# Altium schematic sheet BV100011_ControlSTM32H7.SchDoc
size A3
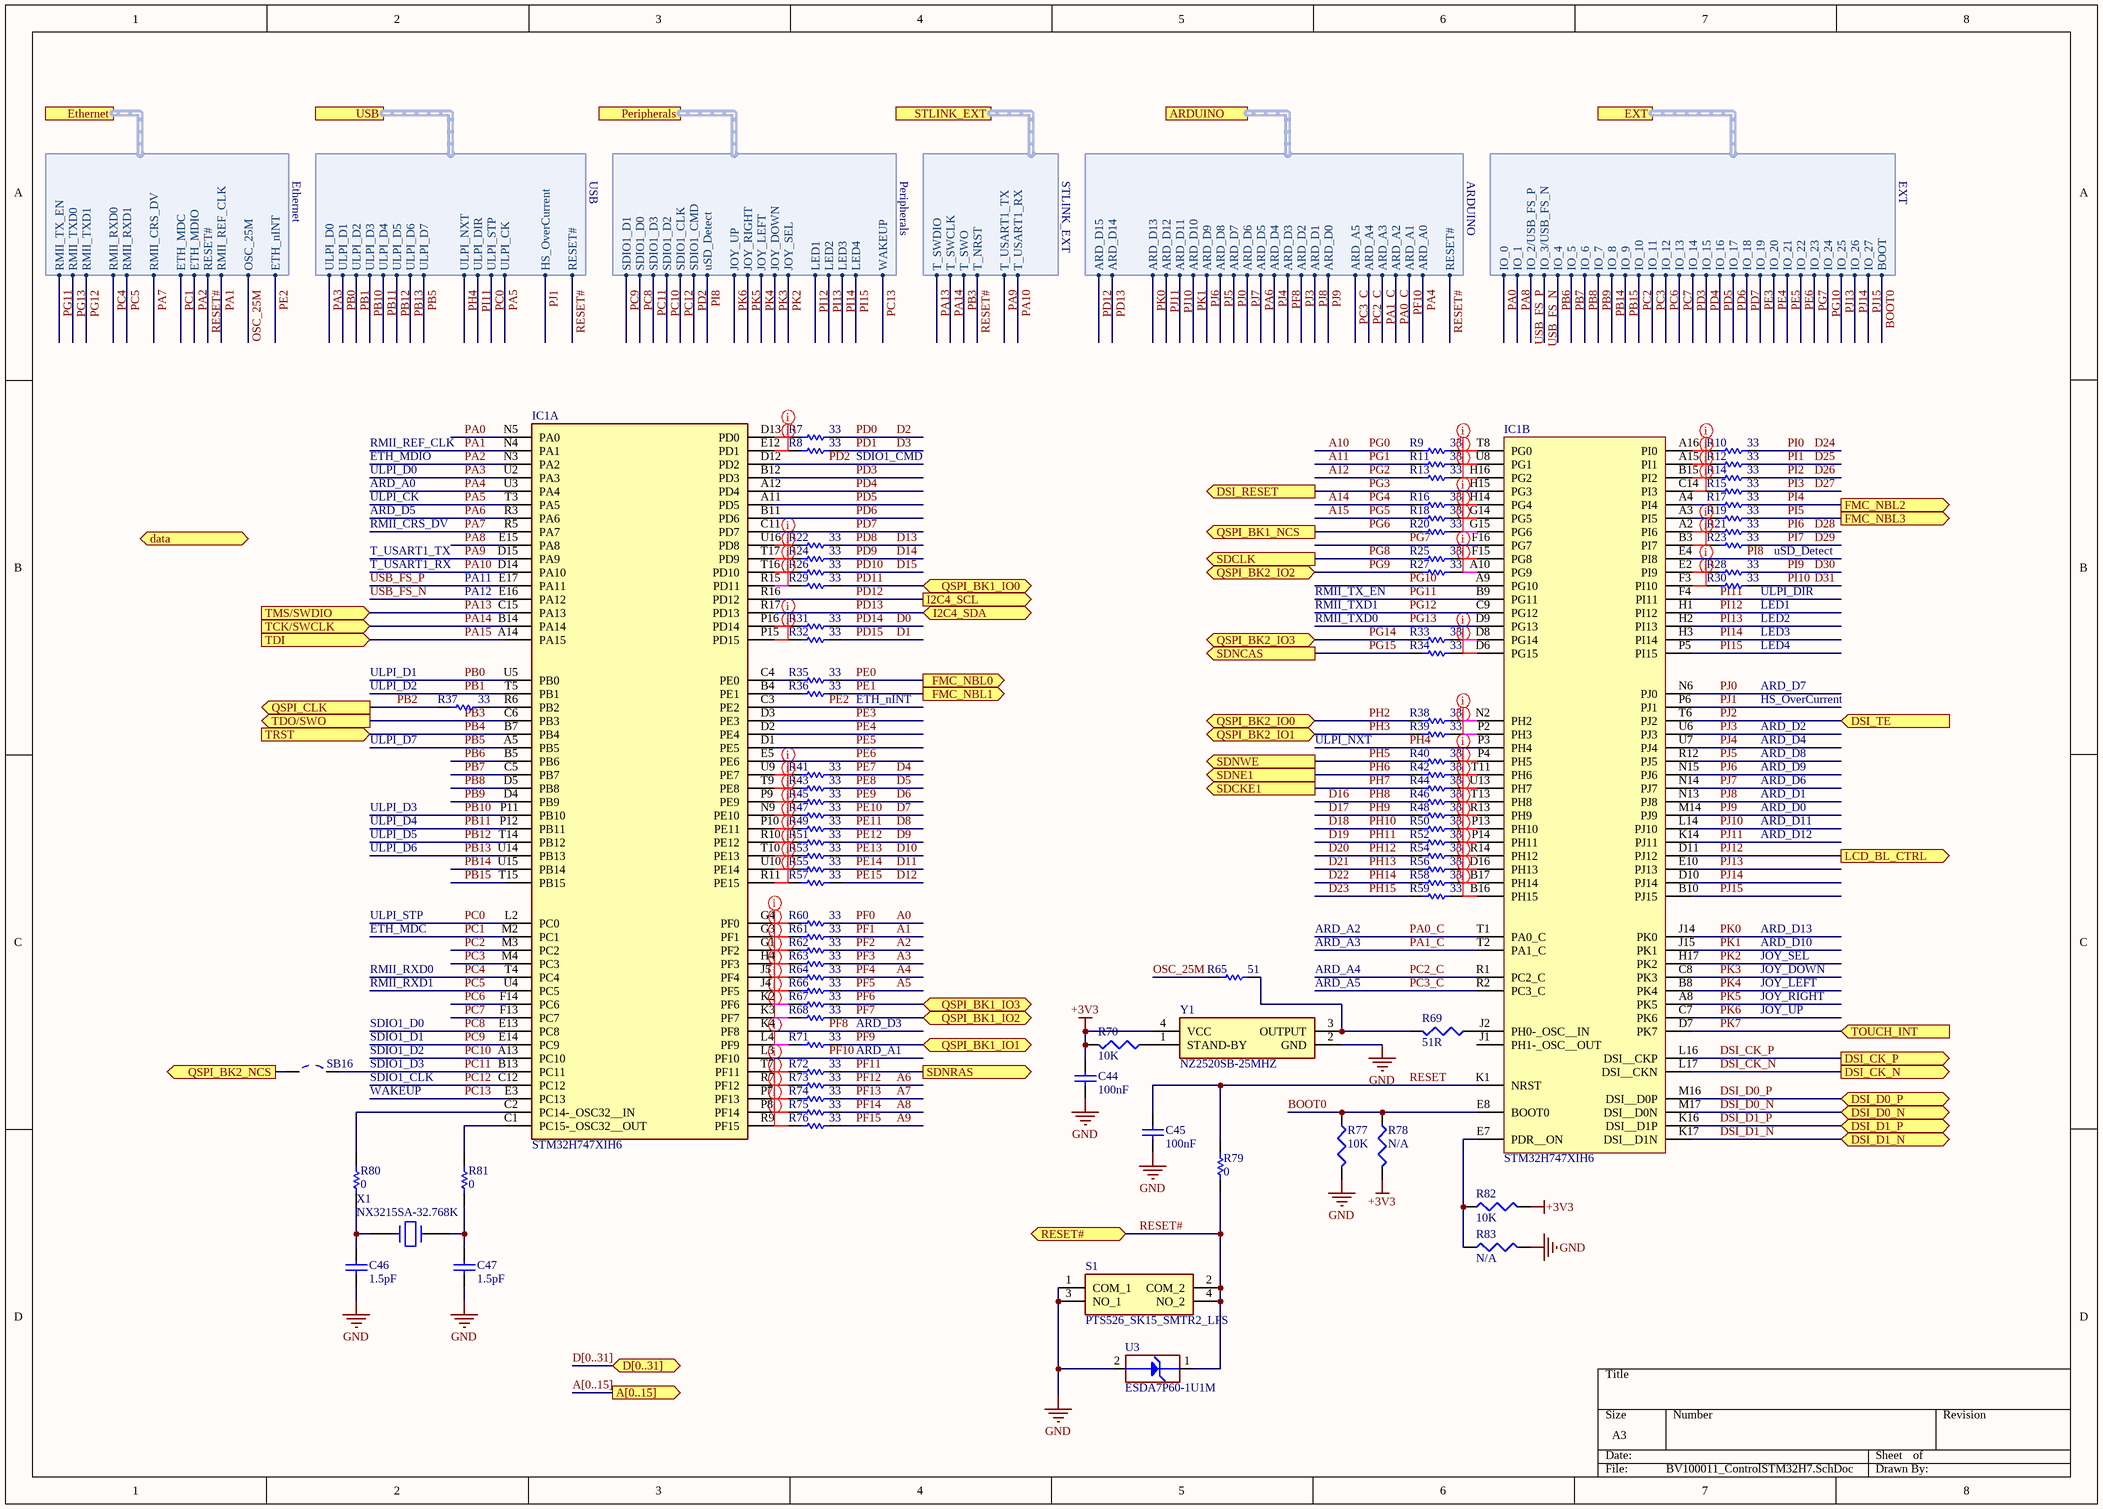
[diagram p0: BV100011_ControlSTM32H7.SchDoc]

## Parts
C44  100nF  [C0402]
C45  100nF  [C0402]
C46  value 1.5pF  [C0402]  (hidden comment: Capacitor)
C47  value 1.5pF  [C0402]  (hidden comment: Capacitor)
IC1  STM32H747XIH6  [BGA265C80P17X17_1400X1400X110]  (parts A,B of 3)
R7  33  [R0402]
R8  33  [R0402]
R9  33  [R0402]
R10  33  [R0402]
R11  33  [R0402]
R12  33  [R0402]
R13  33  [R0402]
R14  33  [R0402]
R15  33  [R0402]
R16  33  [R0402]
R17  33  [R0402]
R18  33  [R0402]
R19  33  [R0402]
R20  33  [R0402]
R21  33  [R0402]
R22  33  [R0402]
R23  33  [R0402]
R24  33  [R0402]
R25  33  [R0402]
R26  33  [R0402]
R27  33  [R0402]
R28  33  [R0402]
R29  33  [R0402]
R30  33  [R0402]
R31  33  [R0402]
R32  33  [R0402]
R33  33  [R0402]
R34  33  [R0402]
R35  33  [R0402]
R36  33  [R0402]
R37  33  [R0402]
R38  33  [R0402]
R39  33  [R0402]
R40  33  [R0402]
R41  33  [R0402]
R42  33  [R0402]
R43  33  [R0402]
R44  33  [R0402]
R45  33  [R0402]
R46  33  [R0402]
R47  33  [R0402]
R48  33  [R0402]
R49  33  [R0402]
R50  33  [R0402]
R51  33  [R0402]
R52  33  [R0402]
R53  33  [R0402]
R54  33  [R0402]
R55  33  [R0402]
R56  33  [R0402]
R57  33  [R0402]
R58  33  [R0402]
R59  33  [R0402]
R60  33  [R0402]
R61  33  [R0402]
R62  33  [R0402]
R63  33  [R0402]
R64  33  [R0402]
R65  51  [R0402]
R66  33  [R0402]
R67  33  [R0402]
R68  33  [R0402]
R69  51R  [R0402]
R70  10K  [R0402]
R71  33  [R0402]
R72  33  [R0402]
R73  33  [R0402]
R74  33  [R0402]
R75  33  [R0402]
R76  33  [R0402]
R77  10K  [R0603]
R78  N/A  [R0603]
R79  0  [R0603]
R80  0  [R0603]
R81  0  [R0603]
R82  10K  [R0603]
R83  N/A  [R0603]
S1  PTS526_SK15_SMTR2_LFS  [PTS526SK15SMTR2LFS]
SB16  Solder Bridge OFF  [SB_0603]  (value not drawn)
U3  value ESDA7P60-1U1M  [ESD_QFN2_1P6X1_P125]  (hidden comment: ESD-TRANSIL)
X1  value NX3215SA-32.768K  [CRY_NX3215SA_2P]  (hidden comment: XTAL_32K_NX3215SA)
Y1  NZ2520SB-25MHZ  [OSC_NDK_NZ2520SB_4P]

## Ports
A[0..15] (out), ARDUINO (harness ARDUINO), D[0..31] (bidir), data (bidir), DSI_CK_N (out), DSI_CK_P (out), DSI_D0_N (bidir), DSI_D0_P (bidir), DSI_D1_N (bidir), DSI_D1_P (bidir), DSI_RESET (out), DSI_TE (in), Ethernet (harness Ethernet), EXT (harness EXT), FMC_NBL0 (out), FMC_NBL1 (out), FMC_NBL2 (out), FMC_NBL3 (out), I2C4_SCL (out), I2C4_SDA (bidir), LCD_BL_CTRL (out), Peripherals (harness Peripherals), QSPI_BK1_IO0 (bidir), QSPI_BK1_IO1 (bidir), QSPI_BK1_IO2 (bidir), QSPI_BK1_IO3 (bidir), QSPI_BK1_NCS (out), QSPI_BK2_IO0 (bidir), QSPI_BK2_IO1 (bidir), QSPI_BK2_IO2 (bidir), QSPI_BK2_IO3 (bidir), QSPI_BK2_NCS (out), QSPI_CLK (out), RESET# (bidir), SDCKE1 (out), SDCLK (out), SDNCAS (out), SDNE1 (out), SDNRAS (out), SDNWE (out), STLINK_EXT (harness STLINK_EXT), TCK/SWCLK (in), TDI (in), TDO/SWO (out), TMS/SWDIO (in), TOUCH_INT (in), TRST (in), USB (harness USB)

## Harnesses
Ethernet: ETH_nINT, ETH_MDC, RMII_REF_CLK, RMII_TXD1, ETH_MDIO, RMII_CRS_DV, RMII_RXD0, RMII_RXD1, RMII_TX_EN, RMII_TXD0, OSC_25M, RESET#
USB: ULPI_D0, ULPI_D1, ULPI_D2, ULPI_D3, ULPI_D4, ULPI_D5, ULPI_D6, ULPI_D7, ULPI_NXT, ULPI_DIR, ULPI_STP, ULPI_CK, RESET#, HS_OverCurrent
Peripherals: SDIO1_D1, SDIO1_D0, SDIO1_D3, SDIO1_D2, SDIO1_CLK, SDIO1_CMD, uSD_Detect, JOY_UP, JOY_RIGHT, JOY_LEFT, JOY_DOWN, JOY_SEL, LED1, LED2, LED3, LED4, WAKEUP
STLINK_EXT: T_SWDIO, T_SWCLK, T_SWO, T_NRST, T_USART1_TX, T_USART1_RX
ARDUINO: RESET#, ARD_A0, ARD_A1, ARD_A2, ARD_A3, ARD_A4, ARD_A5, ARD_D4, ARD_D3, ARD_D2, ARD_D1, ARD_D0, ARD_D9, ARD_D8, ARD_D7, ARD_D6, ARD_D5, ARD_D14, ARD_D13, ARD_D12, ARD_D11, ARD_D10, ARD_D15
EXT: IO_0, IO_1, IO_3/USB_FS_N, IO_4, IO_5, IO_6, IO_7, IO_8, IO_9, IO_10, IO_11, IO_12, IO_13, IO_14, IO_15, IO_16, IO_17, IO_18, IO_19, IO_20, IO_21, IO_22, IO_23, IO_24, IO_25, IO_26, IO_27, BOOT, IO_2/USB_FS_P

## Nets
+3V3: C44.2 R70.2 R78.2 R82.2 Y1.4(VCC)
GND: C44.1 C45.1 C46.1 C47.1 R77.2 R83.2 S1.1(COM_1) S1.3(NO_1) U3.2(GND) Y1.2(GND)
A0: R60.1  [also labelled PF0]
A1: R61.1  [also labelled PF1]
A2: R62.1  [also labelled PF2]
A3: R63.1  [also labelled PF3]
A4: R64.1  [also labelled PF4]
A5: R66.1  [also labelled PF5]
A6: R73.1  [also labelled PF12]
A7: R74.1  [also labelled PF13]
A8: R75.1  [also labelled PF14]
A9: R76.1  [also labelled PF15]
A10: R9.2  [also labelled PG0]
A11: R11.2  [also labelled PG1]
A12: R13.2  [also labelled PG2]
A14: R16.2  [also labelled PG4]
A15: R18.2  [also labelled PG5]
BOOT0: IC1.E8(BOOT0) R77.1 R78.1 ; port EXT.BOOT
D0: R31.1  [also labelled PD14]
D1: R32.1  [also labelled PD15]
D2: R7.1  [also labelled PD0]
D3: R8.1  [also labelled PD1]
D4: R41.1  [also labelled PE7]
D5: R43.1  [also labelled PE8]
D6: R45.1  [also labelled PE9]
D7: R47.1  [also labelled PE10]
D8: R49.1  [also labelled PE11]
D9: R51.1  [also labelled PE12]
D10: R53.1  [also labelled PE13]
D11: R55.1  [also labelled PE14]
D12: R57.1  [also labelled PE15]
D13: R22.1  [also labelled PD8]
D14: R24.1  [also labelled PD9]
D15: R26.1  [also labelled PD10]
D16: R46.2  [also labelled PH8]
D17: R48.2  [also labelled PH9]
D18: R50.2  [also labelled PH10]
D19: R52.2  [also labelled PH11]
D20: R54.2  [also labelled PH12]
D21: R56.2  [also labelled PH13]
D22: R58.2  [also labelled PH14]
D23: R59.2  [also labelled PH15]
D24: R10.1  [also labelled PI0]
D25: R12.1  [also labelled PI1]
D26: R14.1  [also labelled PI2]
D27: R15.1  [also labelled PI3]
D28: R21.1  [also labelled PI6]
D29: R23.1  [also labelled PI7]
D30: R28.1  [also labelled PI9]
D31: R30.1  [also labelled PI10]
DSI_CK_N: IC1.L17(DSI__CKN) ; port DSI_CK_N
DSI_CK_P: IC1.L16(DSI__CKP) ; port DSI_CK_P
DSI_D0_N: IC1.M17(DSI__D0N) ; port DSI_D0_N
DSI_D0_P: IC1.M16(DSI__D0P) ; port DSI_D0_P
DSI_D1_N: IC1.K17(DSI__D1N) ; port DSI_D1_N
DSI_D1_P: IC1.K16(DSI__D1P) ; port DSI_D1_P
OSC_25M: R65.2 ; port Ethernet.OSC_25M
PA0: IC1.N5(PA0) ; port EXT.IO_0
PA0_C: IC1.T1(PA0_C) ; port ARDUINO.ARD_A2
PA1: IC1.N4(PA1) ; port Ethernet.RMII_REF_CLK
PA1_C: IC1.T2(PA1_C) ; port ARDUINO.ARD_A3
PA2: IC1.N3(PA2) ; port Ethernet.ETH_MDIO
PA3: IC1.U2(PA3) ; port USB.ULPI_D0
PA4: IC1.U3(PA4) ; port ARDUINO.ARD_A0
PA5: IC1.T3(PA5) ; port USB.ULPI_CK
PA6: IC1.R3(PA6) ; port ARDUINO.ARD_D5
PA7: IC1.R5(PA7) ; port Ethernet.RMII_CRS_DV
PA8: IC1.E15(PA8) ; port EXT.IO_1
PA9: IC1.D15(PA9) ; port STLINK_EXT.T_USART1_TX
PA10: IC1.D14(PA10) ; port STLINK_EXT.T_USART1_RX
PA13: IC1.C15(PA13) ; port TMS/SWDIO, port STLINK_EXT.T_SWDIO
PA14: IC1.B14(PA14) ; port TCK/SWCLK, port STLINK_EXT.T_SWCLK
PA15: IC1.A14(PA15) ; port TDI
PB0: IC1.U5(PB0) ; port USB.ULPI_D1
PB1: IC1.T5(PB1) ; port USB.ULPI_D2
PB2: R37.2 ; port QSPI_CLK
PB3: IC1.C6(PB3) ; port TDO/SWO, port STLINK_EXT.T_SWO
PB4: IC1.B7(PB4) ; port TRST
PB5: IC1.A5(PB5) ; port USB.ULPI_D7
PB6: IC1.B5(PB6) ; port EXT.IO_4
PB7: IC1.C5(PB7) ; port EXT.IO_5
PB8: IC1.D5(PB8) ; port EXT.IO_6
PB9: IC1.D4(PB9) ; port EXT.IO_7
PB10: IC1.P11(PB10) ; port USB.ULPI_D3
PB11: IC1.P12(PB11) ; port USB.ULPI_D4
PB12: IC1.T14(PB12) ; port USB.ULPI_D5
PB13: IC1.U14(PB13) ; port USB.ULPI_D6
PB14: IC1.U15(PB14) ; port EXT.IO_8
PB15: IC1.T15(PB15) ; port EXT.IO_9
PC0: IC1.L2(PC0) ; port USB.ULPI_STP
PC1: IC1.M2(PC1) ; port Ethernet.ETH_MDC
PC2: IC1.M3(PC2) ; port EXT.IO_10
PC2_C: IC1.R1(PC2_C) ; port ARDUINO.ARD_A4
PC3: IC1.M4(PC3) ; port EXT.IO_11
PC3_C: IC1.R2(PC3_C) ; port ARDUINO.ARD_A5
PC4: IC1.T4(PC4) ; port Ethernet.RMII_RXD0
PC5: IC1.U4(PC5) ; port Ethernet.RMII_RXD1
PC6: IC1.F14(PC6) ; port EXT.IO_12
PC7: IC1.F13(PC7) ; port EXT.IO_13
PC8: IC1.E13(PC8) ; port Peripherals.SDIO1_D0
PC9: IC1.E14(PC9) ; port Peripherals.SDIO1_D1
PC10: IC1.A13(PC10) ; port Peripherals.SDIO1_D2
PC11: IC1.B13(PC11) SB16.2 ; port Peripherals.SDIO1_D3
PC12: IC1.C12(PC12) ; port Peripherals.SDIO1_CLK
PC13: IC1.E3(PC13) ; port Peripherals.WAKEUP
PD2: IC1.D12(PD2) ; port Peripherals.SDIO1_CMD
PD3: IC1.B12(PD3) ; port EXT.IO_14
PD4: IC1.A12(PD4) ; port EXT.IO_15
PD5: IC1.A11(PD5) ; port EXT.IO_16
PD6: IC1.B11(PD6) ; port EXT.IO_17
PD7: IC1.C11(PD7) ; port EXT.IO_18
PD11: R29.1 ; port QSPI_BK1_IO0
PD12: IC1.R16(PD12) ; port I2C4_SCL, port ARDUINO.ARD_D15
PD13: IC1.R17(PD13) ; port I2C4_SDA, port ARDUINO.ARD_D14
PE0: R35.1 ; port FMC_NBL0
PE1: R36.1 ; port FMC_NBL1
PE2: IC1.C3(PE2) ; port Ethernet.ETH_nINT
PE3: IC1.D3(PE3) ; port EXT.IO_19
PE4: IC1.D2(PE4) ; port EXT.IO_20
PE5: IC1.D1(PE5) ; port EXT.IO_21
PE6: IC1.E5(PE6) ; port EXT.IO_22
PF6: R67.1 ; port QSPI_BK1_IO3
PF7: R68.1 ; port QSPI_BK1_IO2
PF8: IC1.K4(PF8) ; port ARDUINO.ARD_D3
PF9: R71.1 ; port QSPI_BK1_IO1
PF10: IC1.L3(PF10) ; port ARDUINO.ARD_A1
PF11: R72.1 ; port SDNRAS
PG3: IC1.H15(PG3) ; port DSI_RESET
PG6: R20.2 ; port QSPI_BK1_NCS
PG7: IC1.F16(PG7) ; port EXT.IO_23
PG8: R25.2 ; port SDCLK
PG9: R27.2 ; port QSPI_BK2_IO2
PG10: IC1.A9(PG10) ; port EXT.IO_24
PG11: IC1.B9(PG11) ; port Ethernet.RMII_TX_EN
PG12: IC1.C9(PG12) ; port Ethernet.RMII_TXD1
PG13: IC1.D9(PG13) ; port Ethernet.RMII_TXD0
PG14: R33.2 ; port QSPI_BK2_IO3
PG15: R34.2 ; port SDNCAS
PH2: R38.2 ; port QSPI_BK2_IO0
PH3: R39.2 ; port QSPI_BK2_IO1
PH4: IC1.P3(PH4) ; port USB.ULPI_NXT
PH5: R40.2 ; port SDNWE
PH6: R42.2 ; port SDNE1
PH7: R44.2 ; port SDCKE1
PI4: R17.1 ; port FMC_NBL2
PI5: R19.1 ; port FMC_NBL3
PI8: IC1.E4(PI8) ; port Peripherals.uSD_Detect
PI11: IC1.F4(PI11) ; port USB.ULPI_DIR
PI12: IC1.H1(PI12) ; port Peripherals.LED1
PI13: IC1.H2(PI13) ; port Peripherals.LED2
PI14: IC1.H3(PI14) ; port Peripherals.LED3
PI15: IC1.P5(PI15) ; port Peripherals.LED4
PJ0: IC1.N6(PJ0) ; port ARDUINO.ARD_D7
PJ1: IC1.P6(PJ1) ; port USB.HS_OverCurrent
PJ2: IC1.T6(PJ2) ; port DSI_TE
PJ3: IC1.U6(PJ3) ; port ARDUINO.ARD_D2
PJ4: IC1.U7(PJ4) ; port ARDUINO.ARD_D4
PJ5: IC1.R12(PJ5) ; port ARDUINO.ARD_D8
PJ6: IC1.N15(PJ6) ; port ARDUINO.ARD_D9
PJ7: IC1.N14(PJ7) ; port ARDUINO.ARD_D6
PJ8: IC1.N13(PJ8) ; port ARDUINO.ARD_D1
PJ9: IC1.M14(PJ9) ; port ARDUINO.ARD_D0
PJ10: IC1.L14(PJ10) ; port ARDUINO.ARD_D11
PJ11: IC1.K14(PJ11) ; port ARDUINO.ARD_D12
PJ12: IC1.D11(PJ12) ; port LCD_BL_CTRL
PJ13: IC1.E10(PJ13) ; port EXT.IO_25
PJ14: IC1.D10(PJ14) ; port EXT.IO_26
PJ15: IC1.B10(PJ15) ; port EXT.IO_27
PK0: IC1.J14(PK0) ; port ARDUINO.ARD_D13
PK1: IC1.J15(PK1) ; port ARDUINO.ARD_D10
PK2: IC1.H17(PK2) ; port Peripherals.JOY_SEL
PK3: IC1.C8(PK3) ; port Peripherals.JOY_DOWN
PK4: IC1.B8(PK4) ; port Peripherals.JOY_LEFT
PK5: IC1.A8(PK5) ; port Peripherals.JOY_RIGHT
PK6: IC1.C7(PK6) ; port Peripherals.JOY_UP
PK7: IC1.D7(PK7) ; port TOUCH_INT
QSPI_BK2_NCS: SB16.1 ; port QSPI_BK2_NCS
RESET: C45.2 IC1.K1(NRST) R79.1
RESET#: R79.2 S1.2(COM_2) S1.4(NO_2) U3.1(IO1) ; port RESET#, port Ethernet.RESET#, port USB.RESET#, port STLINK_EXT.T_NRST, port ARDUINO.RESET#
USB_FS_N: IC1.E16(PA12) ; port EXT.IO_3/USB_FS_N
USB_FS_P: IC1.E17(PA11) ; port EXT.IO_2/USB_FS_P
NetC46_2: C46.2 R80.2 X1.1
NetC47_2: C47.2 R81.2 X1.2
NetIC1_A2: IC1.A2(PI6) R21.2
NetIC1_A3: IC1.A3(PI5) R19.2
NetIC1_A4: IC1.A4(PI4) R17.2
NetIC1_A10: IC1.A10(PG9) R27.1
NetIC1_A15: IC1.A15(PI1) R12.2
NetIC1_A16: IC1.A16(PI0) R10.2
NetIC1_B3: IC1.B3(PI7) R23.2
NetIC1_B4: IC1.B4(PE1) R36.2
NetIC1_B15: IC1.B15(PI2) R14.2
NetIC1_B16: IC1.B16(PH15) R59.1
NetIC1_B17: IC1.B17(PH14) R58.1
NetIC1_C1: IC1.C1(PC15-_OSC32__OUT) R81.1
NetIC1_C2: IC1.C2(PC14-_OSC32__IN) R80.1
NetIC1_C4: IC1.C4(PE0) R35.2
NetIC1_C14: IC1.C14(PI3) R15.2
NetIC1_D6: IC1.D6(PG15) R34.1
NetIC1_D8: IC1.D8(PG14) R33.1
NetIC1_D13: IC1.D13(PD0) R7.2
NetIC1_D16: IC1.D16(PH13) R56.1
NetIC1_E2: IC1.E2(PI9) R28.2
NetIC1_E7: IC1.E7(PDR__ON) R82.1 R83.1
NetIC1_E12: IC1.E12(PD1) R8.2
NetIC1_F3: IC1.F3(PI10) R30.2
NetIC1_F15: IC1.F15(PG8) R25.1
NetIC1_G1: IC1.G1(PF2) R62.2
NetIC1_G3: IC1.G3(PF1) R61.2
NetIC1_G4: IC1.G4(PF0) R60.2
NetIC1_G14: IC1.G14(PG5) R18.1
NetIC1_G15: IC1.G15(PG6) R20.1
NetIC1_H4: IC1.H4(PF3) R63.2
NetIC1_H14: IC1.H14(PG4) R16.1
NetIC1_H16: IC1.H16(PG2) R13.1
NetIC1_J2: IC1.J2(PH0-_OSC__IN) R69.1
NetIC1_J4: IC1.J4(PF5) R66.2
NetIC1_J5: IC1.J5(PF4) R64.2
NetIC1_K2: IC1.K2(PF6) R67.2
NetIC1_K3: IC1.K3(PF7) R68.2
NetIC1_L4: IC1.L4(PF9) R71.2
NetIC1_N2: IC1.N2(PH2) R38.1
NetIC1_N9: IC1.N9(PE10) R47.2
NetIC1_P2: IC1.P2(PH3) R39.1
NetIC1_P4: IC1.P4(PH5) R40.1
NetIC1_P7: IC1.P7(PF13) R74.2
NetIC1_P8: IC1.P8(PF14) R75.2
NetIC1_P9: IC1.P9(PE9) R45.2
NetIC1_P10: IC1.P10(PE11) R49.2
NetIC1_P13: IC1.P13(PH10) R50.1
NetIC1_P14: IC1.P14(PH11) R52.1
NetIC1_P15: IC1.P15(PD15) R32.2
NetIC1_P16: IC1.P16(PD14) R31.2
NetIC1_R6: IC1.R6(PB2) R37.1
NetIC1_R7: IC1.R7(PF12) R73.2
NetIC1_R9: IC1.R9(PF15) R76.2
NetIC1_R10: IC1.R10(PE12) R51.2
NetIC1_R11: IC1.R11(PE15) R57.2
NetIC1_R13: IC1.R13(PH9) R48.1
NetIC1_R14: IC1.R14(PH12) R54.1
NetIC1_R15: IC1.R15(PD11) R29.2
NetIC1_T7: IC1.T7(PF11) R72.2
NetIC1_T8: IC1.T8(PG0) R9.1
NetIC1_T9: IC1.T9(PE8) R43.2
NetIC1_T10: IC1.T10(PE13) R53.2
NetIC1_T11: IC1.T11(PH6) R42.1
NetIC1_T13: IC1.T13(PH8) R46.1
NetIC1_T16: IC1.T16(PD10) R26.2
NetIC1_T17: IC1.T17(PD9) R24.2
NetIC1_U8: IC1.U8(PG1) R11.1
NetIC1_U9: IC1.U9(PE7) R41.2
NetIC1_U10: IC1.U10(PE14) R55.2
NetIC1_U13: IC1.U13(PH7) R44.1
NetIC1_U16: IC1.U16(PD8) R22.2
NetR65_1: R65.1 R69.2 Y1.3(OUTPUT)
NetR70_1: R70.1 Y1.1(STAND-BY)

Not connected (* = marked no-connect by the designer): IC1 J1(PH1-_OSC__OUT)

## Buses and harness runs
bus A[0..15] = port A[0..15]
bus D[0..31] = port D[0..31]

## Layout directives
net class SDRAM_MCU; rule Matched Net Lengths [Tolerance = 100mil]: NetIC1_A2, NetIC1_A15, NetIC1_A16, NetIC1_B3, NetIC1_B15, NetIC1_B16, NetIC1_B17, NetIC1_C14, NetIC1_D6, NetIC1_D13, NetIC1_D16, NetIC1_E2, NetIC1_E12, NetIC1_F3, NetIC1_F15, NetIC1_G1, NetIC1_G3, NetIC1_G4, NetIC1_G14, NetIC1_H4, NetIC1_H14, NetIC1_H16, NetIC1_J4, NetIC1_J5, NetIC1_N9, NetIC1_P4, NetIC1_P7, NetIC1_P8, NetIC1_P9, NetIC1_P10, NetIC1_P13, NetIC1_P14, NetIC1_P15, NetIC1_P16, NetIC1_R7, NetIC1_R9, NetIC1_R10, NetIC1_R11, NetIC1_R13, NetIC1_R14, NetIC1_T7, NetIC1_T8, NetIC1_T9, NetIC1_T10, NetIC1_T11, NetIC1_T13, NetIC1_T16, NetIC1_T17, NetIC1_U8, NetIC1_U9, NetIC1_U10, NetIC1_U13, NetIC1_U16
rule Matched Net Lengths [Tolerance = 100mil]; net class QSPI_MCU: NetIC1_A10, NetIC1_D8, NetIC1_G15, NetIC1_K2, NetIC1_K3, NetIC1_L4, NetIC1_N2, NetIC1_P2, NetIC1_R15

## Notes on the sheet
- RMII_REF_CLK
- ETH_MDIO
- ULPI_D0
- ULPI_CK
- ARD_A0
- ARD_D5
- SDIO1_CMD
- RMII_CRS_DV
- T_USART1_TX
- T_USART1_RX
- (near IC1) PA11
- uSD_Detect
- (near IC1) PA12
- RMII_TX_EN
- RMII_TXD1
- RMII_TXD0
- ULPI_DIR
- LED1
- LED2
- LED3
- LED4
- (near R37) ULPI_D1
- (near R37) ULPI_D2
- ETH_nINT
- HS_OverCurrent
- ARD_D7
- (near R37) ULPI_D7
- ULPI_NXT
- ARD_D2
- ARD_D4
- ARD_D6
- ARD_D8
- ARD_D9
- ULPI_D3
- ULPI_D4
- ULPI_D5
- ULPI_D6
- ARD_D0
- ARD_D1
- ARD_D11
- ARD_D12
- ULPI_STP
- ETH_MDC
- RMII_RXD0
- RMII_RXD1
- ARD_A2
- ARD_A3
- ARD_A4
- (near Y1) ARD_A5
- JOY_SEL
- JOY_DOWN
- JOY_LEFT
- ARD_D10
- ARD_D13
- SDIO1_D0
- (near SB16) SDIO1_D1
- (near SB16) SDIO1_D2
- ARD_A1
- ARD_D3
- JOY_RIGHT
- JOY_UP
- WAKEUP
- (near SB16) SDIO1_D3
- (near SB16) SDIO1_CLK

## Library data of the parts
C44 C45 = Cap Semi: Capacitor (Semiconductor SIM Model); Published: 8-Jun-2000; LatestRevisionDate: 29-May-2009; LatestRevisionNote: IPC-7351 Footprint Added.; PackageReference: C1206; Publisher: Altium Limited; PackageDescription: Chip Capacitor; Value: 100nF
C46 C47 = MCD-00563: Capacitor, MLCC, 1.5pF, 50V, NPO, +-0.25pF, 0402, T=0,5mm; Manufacturer_Part_Number: CC0402CRNPO9BN1R5; Manufacturer: YAGEO; Provided_By: Subcon; Initial_Board_Reference: MB1331; Internal_Part_Number: MCD-00563; Status: Released; Part_Type: Capacitor; Package: C0402; ComponentLink1Description: Yageo_Capacitor_NP0_16V-to-50V.pdf; ComponentLink1URL: http://tunmcdsvn.tun.st.com/Component_Datasheet_Library/Trunk/Capacitors/Yageo_Capacitor_NP0_16V-to-50V; ECCN_US: n/a; ECCN_EU: n/a
IC1 = STM32H747XIH6: Integrated Circuit; Manufacturer_Name: STMicroelectronics; Datasheet Link: https://www.st.com/en/microcontrollers-microprocessors/stm32h747xi.html; Height: 1.1mm; Manufacturer_Part_Number: STM32H747XIH6; Mouser Part Number: 511-STM32H747XIH6; Mouser Price/Stock: https://www.mouser.com/Search/Refine.aspx?Keyword=511-STM32H747XIH6
R7-R68 R71-R76 R80 R81 = Res1: Resistor; Value: 1K; Published: 8-Jun-2000; Revision: July-2002: Re-released for DXP Platform.; Publisher: Altium Limited
R69 R70 R77 R78 R82 R83 = Res3: Resistor; Published: 8-Jun-2000; LatestRevisionDate: 29-May-2009; LatestRevisionNote: IPC-7351 Footprint Added.; PackageReference: J1-0603; Publisher: Altium Limited; PackageDescription: Chip Resistor
  R69: Value: 51R
  R70 R77 R82: Value: 10K
  R78 R83: Value: N/A
R79 = res1: Resistor; Value: 1K; Published: 8-Jun-2000; Revision: July-2002: Re-released for DXP Platform.; Publisher: Altium Limited
S1 = PTS526_SK15_SMTR2_LFS: Switch; Manufacturer_Name: C & K COMPONENTS; Manufacturer_Part_Number: PTS526 SK15 SMTR2 LFS; Datasheet Link: https://www.ckswitches.com/media/2780/pts526.pdf; Height: 1.65mm; Mouser Part Number: 611-PTS526SK15SMR2L; Mouser Price/Stock: https://www.mouser.com/Search/Refine.aspx?Keyword=611-PTS526SK15SMR2L
SB16 = SB_OFF: Fitted: NO; Ordered by: Subcon; Revision: July-2002: Re-released for DXP Platform.; ECCN_US/EU: n/a
U3 = MCD-00251: High power transient voltage suppressor, 7V breakdown; Part_Type: IC; Manufacturer: STMICROELECTRONICS; ECCN_US: EAR99; ECCN_EU: NEC; Provided_By: Subcon; Initial_Board_Reference: MB1311; Internal_Part_Number: MCD-00251; Status: Released; Manufacturer_Part_Number: ESDA7P60-1U1M; ComponentLink1Description: STM_ESD_ESDA7P60-1U1M.pdf; ComponentLink1URL: http://tunmcdsvn.tun.st.com/Component_Datasheet_Library/Trunk/Diodes/STM_ESD_ESDA7P60-1U1M
X1 = MCD-00091: Crystal 32.768kHz, 6pF, -+20PPM, R=50K, SMD; Part_Type: Crystal_Osc; Manufacturer_Part_Number: NX3215SA 32.768KHz EXS00A-MU00525; Manufacturer: NDK; ECCN_US: EAR99; ECCN_EU: NEC; Provided_By: STM; Initial_Board_Reference: mb1274; Internal_Part_Number: MCD-00091; Status: Released; ComponentLink1Description: NDK_Crystal-For-ST_NX3215SA 32.768KHz EXS00A-MU00525 (EXS10B-21238).pdf; ComponentLink1URL: http://tunmcdsvn.tun.st.com/Component_Datasheet_Library/Trunk/Crystal_Osc/NDK_Crystal-For-ST_NX3215SA 32.768KHz EXS00A-MU00525 (EXS10B-21238).pdf
Y1 = NZ2520SB-25.600MHZ: Crystal or Oscillator; Manufacturer_Name: NDK; Datasheet Link: https://media.digikey.com/PDF/Data%20Sheets/NDK%20PDFs/NZ2520SB.pdf; Height: 0.9mm; Manufacturer_Part_Number: NZ2520SB-25.600MHZ; Mouser Part Number: N/A; Mouser Price/Stock: https://www.mouser.com/Search/Refine.aspx?Keyword=N%2FA